# Altium schematic sheet A3_2_G.SchDoc
size 421 x 297 mm; SheetNumber: №; SheetTotal: №№; ESKD_Oformil: ФИО; ESKD_Proveril: ФИО; ESKD_DIVG: ДИВГ.хххххх.ххх Э3; ESKD_Razrabotal: ФИО; ESKD_utverdil: Гондуров С.А.
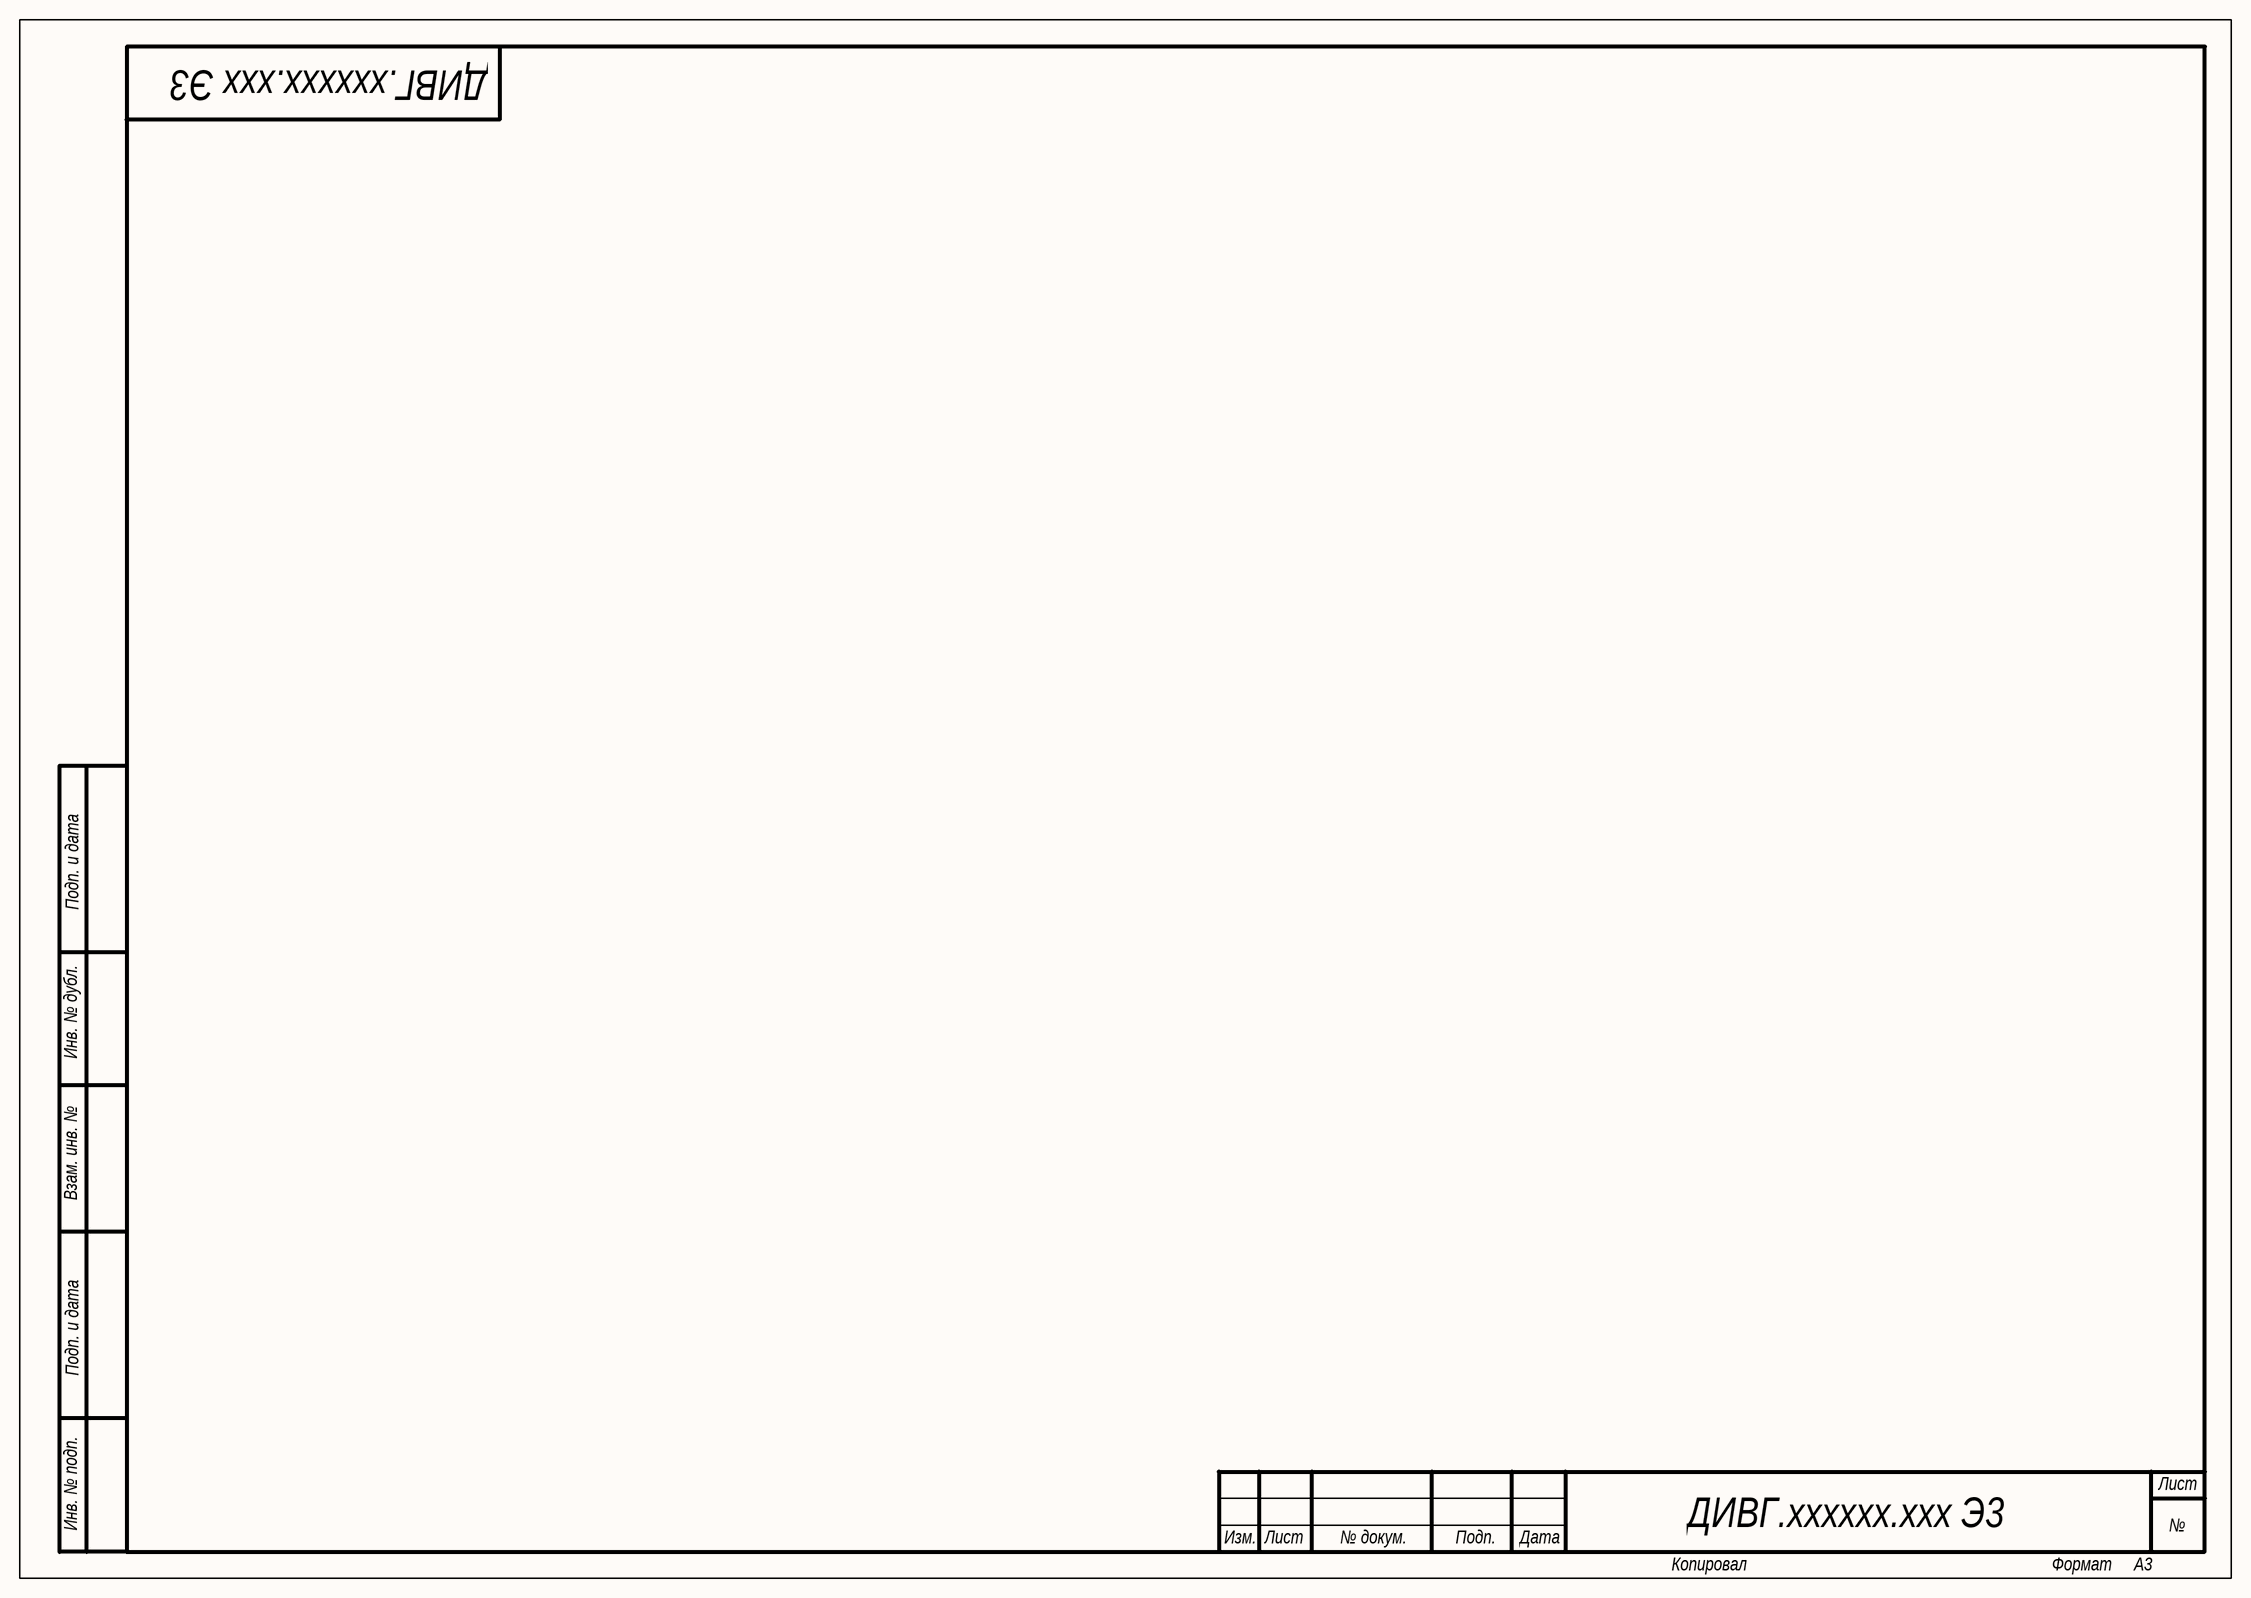
[diagram p0: A3_2_G.SchDoc]

## Notes on the sheet
- Подп. и дата
- Инв. № дубл.
- Взам. инв. №
- Инв. № подп.
- Лист
- Изм.
- № докум.
- Подп.
- Дата
- Копировал
- Формат     А3